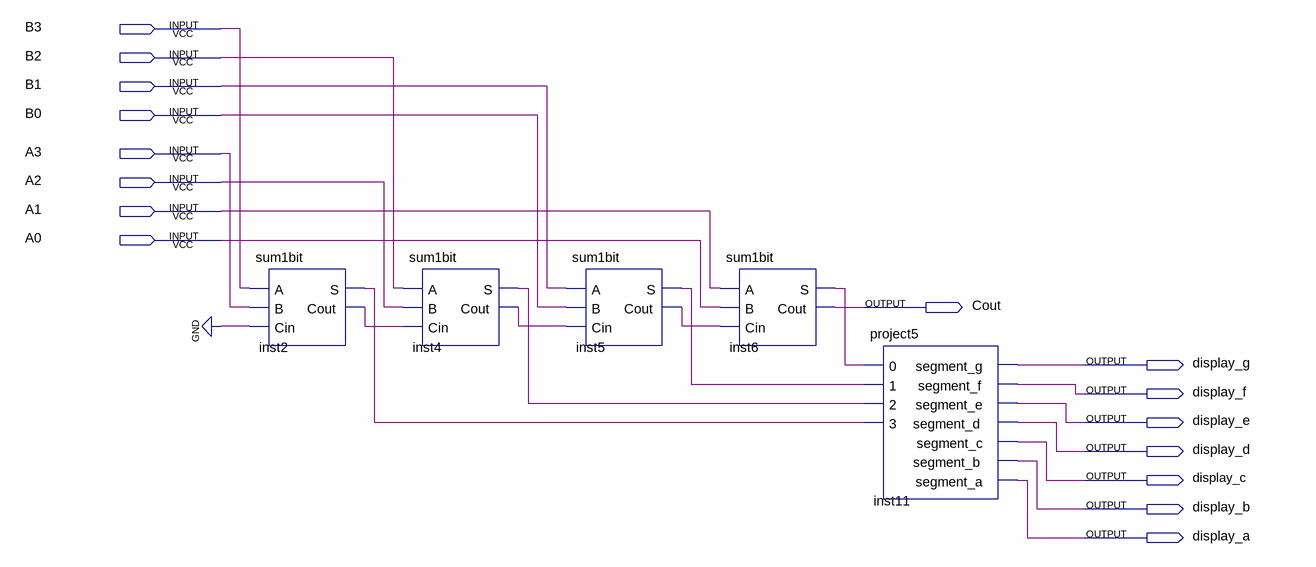
[diagram p0: schematic sheet]
// Quartus schematic project7.bdf as structural Verilog: 5 symbols, 16 pins
module project7 (
  input  B3,
  input  B2,
  input  B1,
  input  B0,
  input  A3,
  input  A2,
  input  A1,
  input  A0,
  output Cout,
  output display_g,
  output display_f,
  output display_e,
  output display_d,
  output display_c,
  output display_b,
  output display_a
);

  wire inst2_cout, inst2_s, inst4_cout, inst4_s, inst5_cout, inst5_s, inst6_s;

  sum1bit inst2 (.A(B3), .B(A3), .Cin(1'b0), .S(inst2_s), .Cout(inst2_cout));
  sum1bit inst4 (.A(B2), .B(A2), .Cin(inst2_cout), .S(inst4_s), .Cout(inst4_cout));
  sum1bit inst5 (.A(B1), .B(B0), .Cin(inst4_cout), .S(inst5_s), .Cout(inst5_cout));
  sum1bit inst6 (.A(A1), .B(A0), .Cin(inst5_cout), .S(inst6_s), .Cout(Cout));
  project5 inst11 (
    .\0 (inst6_s), .\1 (inst5_s), .\2 (inst4_s), .\3 (inst2_s), .segment_g(display_g), .segment_f(display_f),
    .segment_e(display_e), .segment_d(display_d), .segment_c(display_c), .segment_b(display_b),
    .segment_a(display_a));
endmodule
